# EAGLE design motors (EAGLE 6.4)
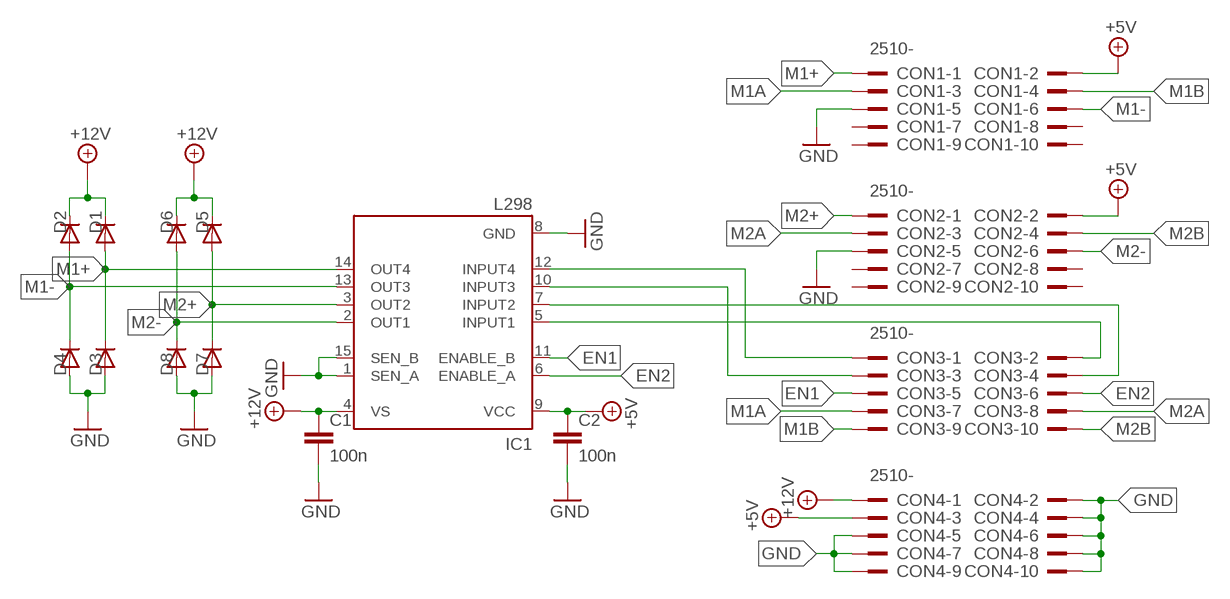
[diagram p0: schematic, sheet 1]

## Parts
C1  100n  C-EU050-025X075  [C050-025X075]
C2  100n  C-EU050-025X075  [C050-025X075]
CON1  2510-  [PAK100/2500-10]
CON2  2510-  [PAK100/2500-10]
CON3  2510-  [PAK100/2500-10]
CON4  2510-  [PAK100/2500-10]
D1  1N4004  [DO41-10]
D2  1N4004  [DO41-10]
D3  1N4004  [DO41-10]
D4  1N4004  [DO41-10]
D5  1N4004  [DO41-10]
D6  1N4004  [DO41-10]
D7  1N4004  [DO41-10]
D8  1N4004  [DO41-10]
IC1  L298  [MULTIWATT-15]

## Nets
+5V: C2.1 CON1.2 CON2.2 CON4.3 IC1.9(VCC)
+12V: C1.1 CON4.1 D1.C D2.C D5.C D6.C IC1.4(VS)
EN1: CON3.5 IC1.11(ENABLE_B)
EN2: CON3.6 IC1.6(ENABLE_A)
GND: C1.2 C2.2 CON1.5 CON2.5 CON4.2 CON4.4 CON4.5 CON4.6 CON4.7 CON4.8 CON4.9 CON4.10 D3.A D4.A D7.A D8.A IC1.1(SEN_A) IC1.8(GND) IC1.15(SEN_B)
M1+: CON1.1 D1.A D3.C IC1.14(OUT4)
M1-: CON1.6 D2.A D4.C IC1.13(OUT3)
M1A: CON1.3 CON3.7
M1B: CON1.4 CON3.9
M2+: CON2.1 D5.A D7.C IC1.3(OUT2)
M2-: CON2.6 D6.A D8.C IC1.2(OUT1)
M2A: CON2.3 CON3.8
M2B: CON2.4 CON3.10
N$1: CON3.3 IC1.10(INPUT3)
N$2: CON3.2 IC1.5(INPUT1)
N$3: CON3.1 IC1.12(INPUT4)
N$11: CON3.4 IC1.7(INPUT2)
Unconnected: CON1.7 CON1.8 CON1.9 CON1.10 CON2.7 CON2.8 CON2.9 CON2.10

## Library data of the parts
C1 C2 = rcl:C-EU: CAPACITOR, European symbol
CON1-CON4 = con-3m:2510-: 3M (TM) Pak 100 4-Wall Header Source: 3M; MF: 3M; MPN: 2510-6002UB; OC_FARNELL: 9838244; OC_NEWARK: 46F4725
D1-D8 = diode:1N4004: DIODE general purpose rectifier, 1 A
IC1 = st-microelectronics:L298: DUAL FULL-BRIDGE DRIVER; MPN: L298N; OC_FARNELL: 1589425; OC_NEWARK: 32M1527

## Board
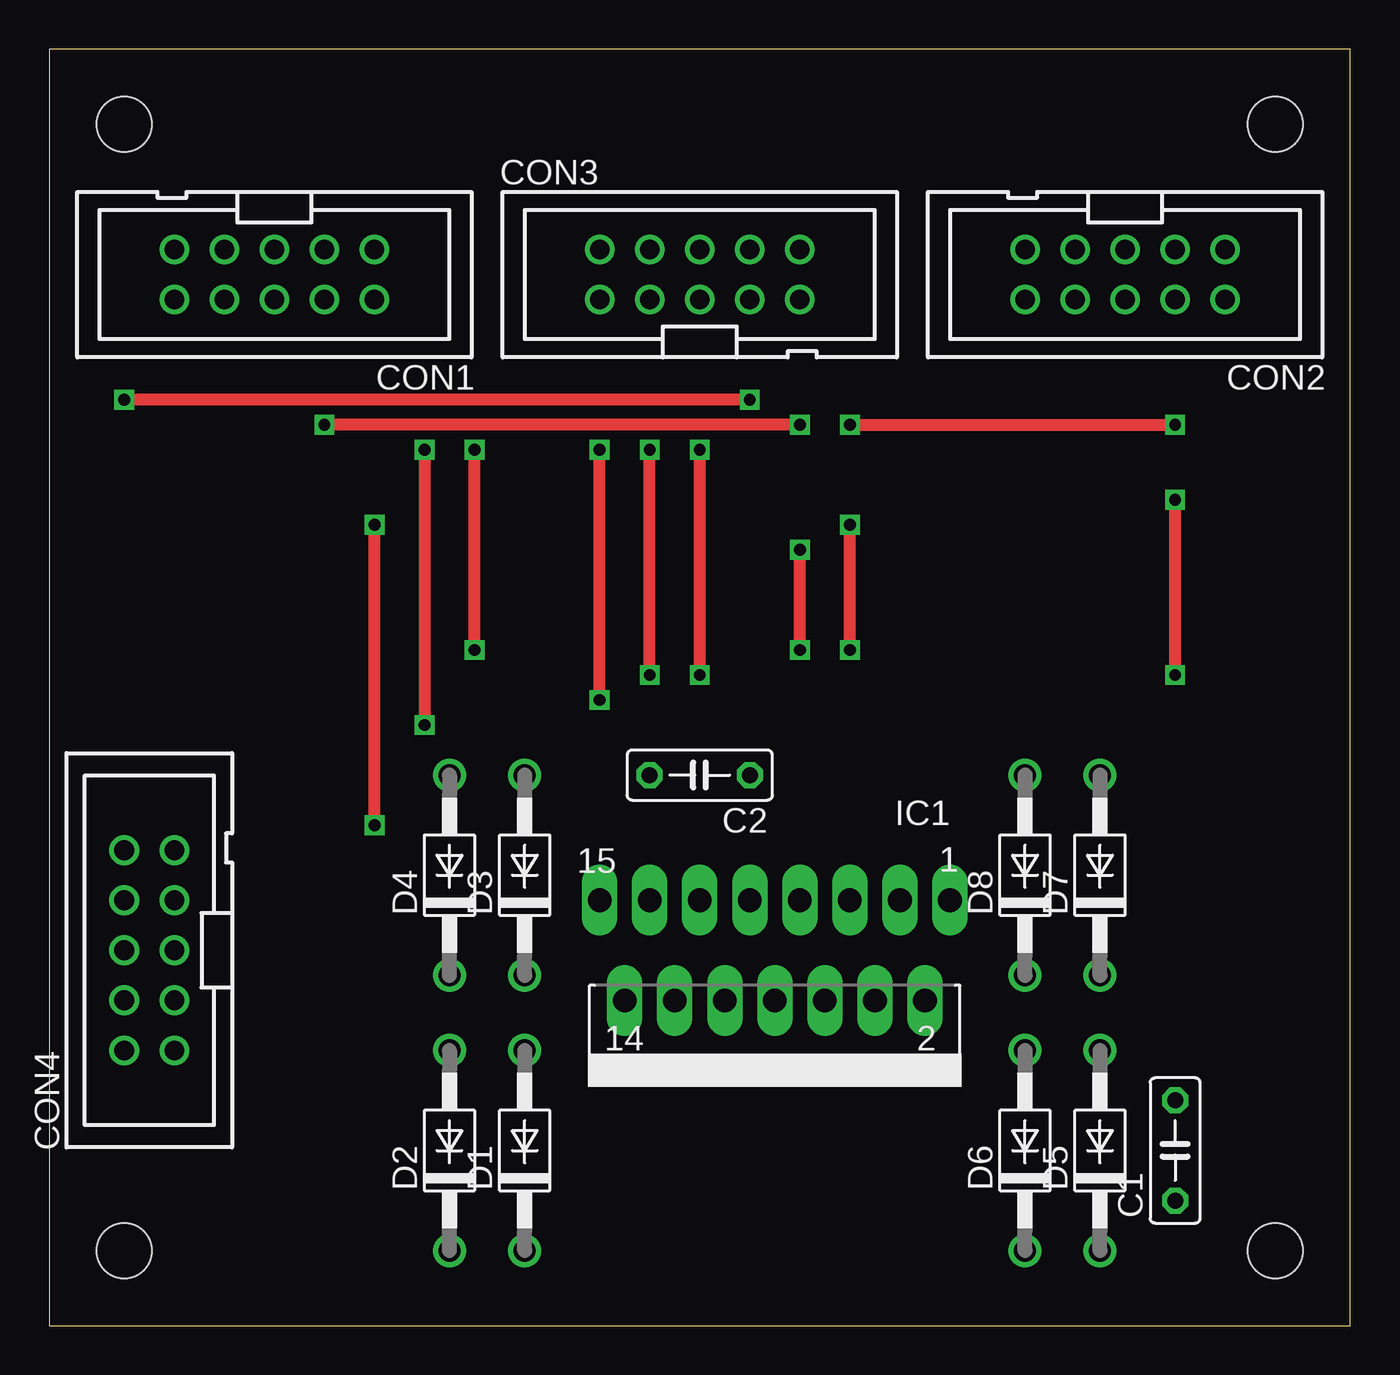
[diagram p1: board, top side]
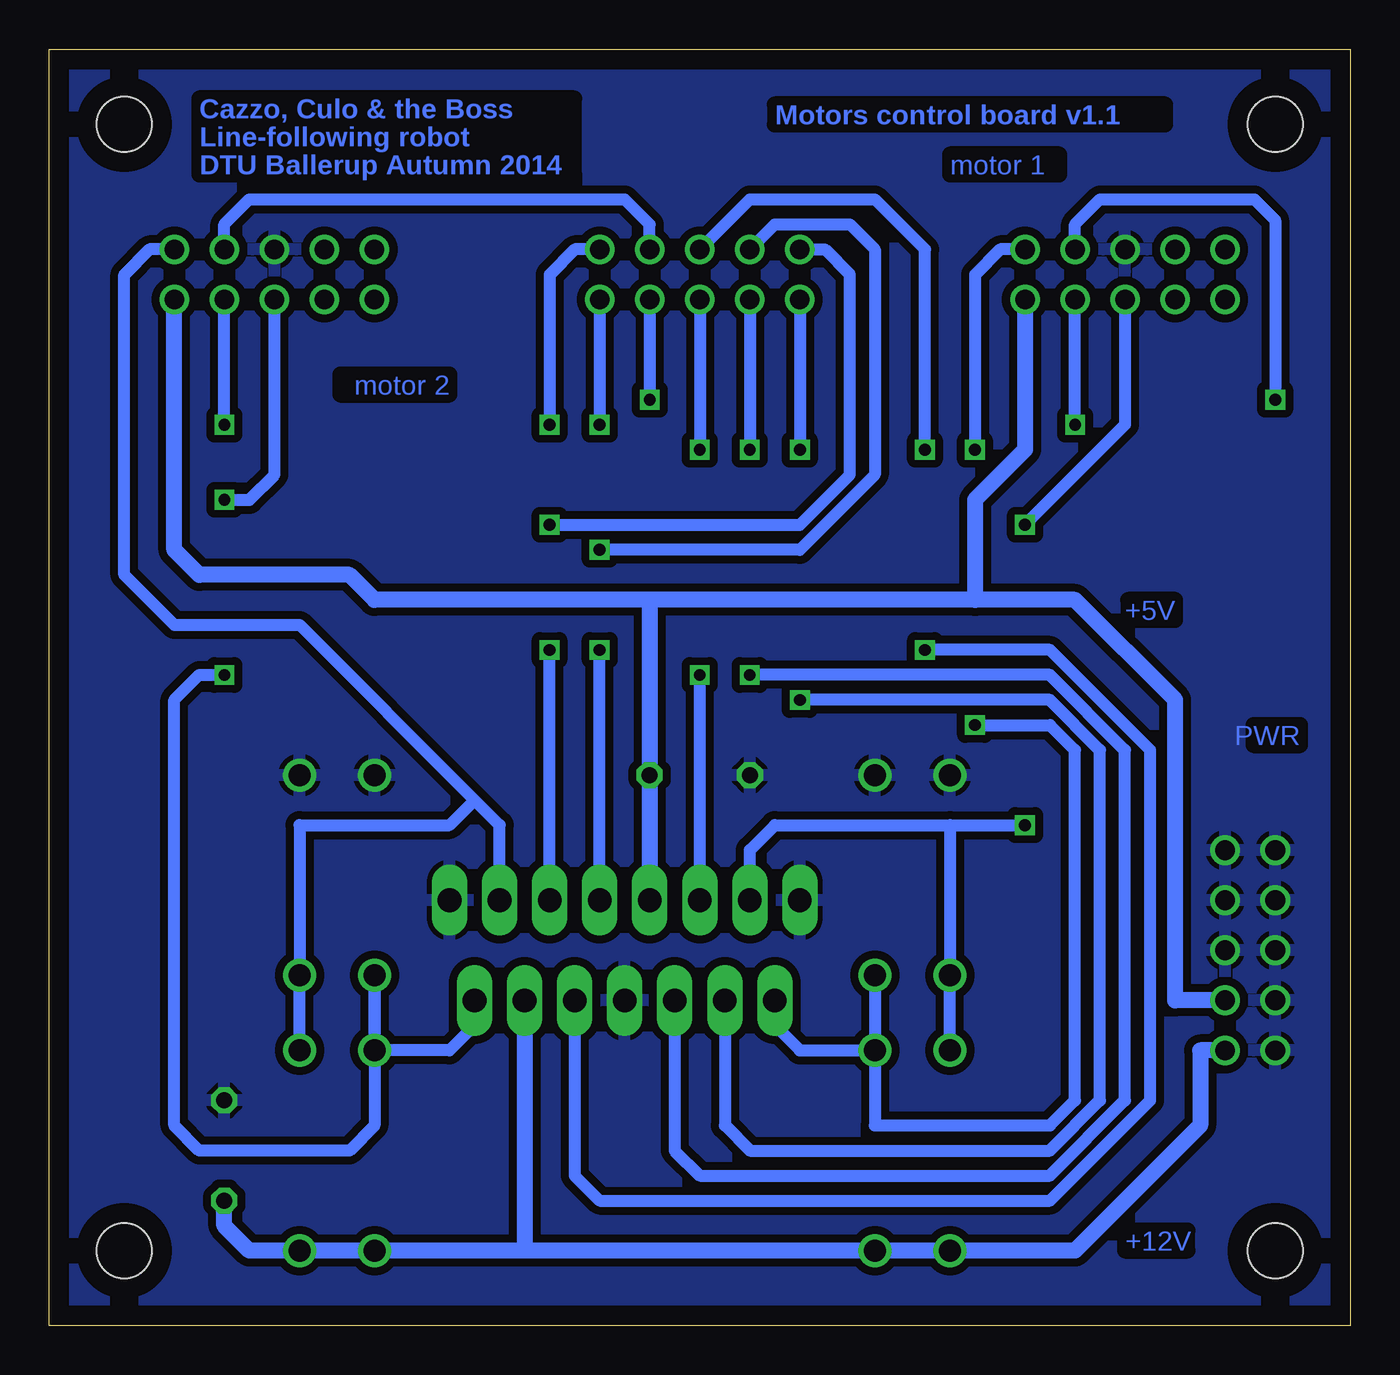
[diagram p2: board, bottom side, seen from below]

Size 66.04 x 64.77 mm. Coordinates in mm from the lower left corner, seen from the top.
Outline: 0,0 66.04,0 66.04,64.77 0,64.77 0,0
Copper layers (1*16): Top 0.035mm / dielectric 1.5mm / Bottom 0.035mm
Design rules "default": minimum track width 10mil, minimum drill 24mil, track to track 8mil, track to pad 8mil, pad to pad 8mil, via to via 8mil, smd to smd 8mil, copper to edge 40mil, drill to drill 8mil, minimum pad ring 10mil, minimum via ring 8mil, stop-mask expansion 4mil, vias tented up to drill 0mil, thermal gap 10mil
Holes 2.8 mm at 3.81,60.96 3.81,3.81 62.23,60.96 62.23,3.81

### Footprints (pad centres in the part's own frame; a part is rotated, then mirrored left to right if it is on the bottom)
C050-025X075 = drill 0.813 octagon: 1 -2.54,0; 2 2.54,0
PAK100/2500-10 = drill 1 pad 1.422: 1 -5.08,-1.27; 2 -5.08,1.27; 3 -2.54,-1.27; 4 -2.54,1.27; 5 0,-1.27; 6 0,1.27; 7 2.54,-1.27; 8 2.54,1.27; 9 5.08,-1.27; 10 5.08,1.27
DO41-10 = drill 1.118: A 5.08,0; C -5.08,0
MULTIWATT-15 = drill 1.2 long: 1 -8.89,-7.62; 2 -7.62,-2.54; 3 -6.35,-7.62; 4 -5.08,-2.54; 5 -3.81,-7.62; 6 -2.54,-2.54; 7 -1.27,-7.62; 8 0,-2.54; 9 1.27,-7.62; 10 2.54,-2.54; 11 3.81,-7.62; 12 5.08,-2.54; 13 6.35,-7.62; 14 7.62,-2.54; 15 8.89,-7.62

### Placement (x,y rotation side)
C1  57.15,8.89 90 top
C2  33.02,27.94 180 top
CON1  11.43,53.34 180 top
CON2  54.61,53.34 180 top
CON3  33.02,53.34 0 top
CON4  5.08,19.05 90 top
D1  24.13,8.89 90 top
D2  20.32,8.89 90 top
D3  24.13,22.86 90 top
D4  20.32,22.86 90 top
D5  53.34,8.89 90 top
D6  49.53,8.89 90 top
D7  53.34,22.86 90 top
D8  49.53,22.86 90 top
IC1  36.83,13.97 180 top

### Tracks (layer width: path | path; a pad name or v marks a point on that pad's centre or on a via)
+5V
  Bottom 0.813: CON4.3 8.89,16.51 8.89,31.75 13.97,36.83 19.05,36.83 | 19.05,36.83 35.56,36.83 | 35.56,36.83 C2.1 IC1.9 | CON1.2 16.51,44.45 19.05,41.91 19.05,36.83 | 35.56,36.83 49.53,36.83 50.8,38.1 58.42,38.1 59.69,39.37 CON2.2
+12V
  Bottom 0.61: D5.C D6.C
  Bottom 0.813: CON4.1 7.62,13.97 7.62,10.16 13.97,3.81 D2.C D1.C 41.91,3.81 | 41.91,3.81 D5.C 55.88,3.81 57.15,5.08 C1.1 | IC1.4 41.91,3.81
EN1  (via drill 0.6)
  Top 0.61: v33.02,33.02 v33.02,44.45
  Bottom 0.61: CON3.5 v33.02,44.45 | IC1.11 v33.02,33.02
EN2  (via drill 0.6)
  Top 0.61: v21.59,34.29 v21.59,44.45
  Bottom 0.61: CON3.6 30.48,57.15 24.13,57.15 21.59,54.61 v21.59,44.45 | 39.37,12.7 IC1.6 39.37,7.62 38.1,6.35 15.24,6.35 10.16,11.43 10.16,29.21 15.24,34.29 v21.59,34.29
GND
  pour Bottom (isolate 0.406): 0,64.77 66.04,64.77 66.04,0 0,0
M1+  (via drill 0.6)
  Top 0.61: v19.05,44.45 v19.05,30.48
  Bottom 0.61: IC1.14 29.21,15.24 27.94,13.97 D1.A D3.C 24.13,10.16 15.24,10.16 13.97,11.43 13.97,29.21 15.24,30.48 v19.05,30.48 | CON1.1 17.78,54.61 19.05,53.34 v19.05,44.45
M1-  (via drill 0.6)
  Top 0.61: v16.51,25.4 v16.51,40.64
  Bottom 0.61: D2.A D4.C 20.32,25.4 | IC1.13 30.48,24.13 29.21,25.4 20.32,25.4 | CON1.6 11.43,45.72 v16.51,40.64 | 20.32,25.4 v16.51,25.4
M1A  (via drill 0.6)
  Top 0.61: v35.56,46.99 v3.81,46.99
  Bottom 0.61: CON1.3 13.97,55.88 12.7,57.15 4.86,57.15 3.81,56.1 v3.81,46.99 | CON3.7 v35.56,46.99
M1B  (via drill 0.6)
  Top 0.61: v38.1,45.72 v13.97,45.72
  Bottom 0.61: CON3.9 v38.1,45.72 | v13.97,45.72 CON1.4
M2+
  Bottom 0.61: D5.A D7.C 53.34,25.4 45.72,25.4 44.45,26.67 | CON2.1 60.96,54.61 62.23,53.34 62.23,38.1 59.69,35.56 53.34,35.56 44.45,26.67 | IC1.3 43.18,25.4 44.45,26.67
M2-  (via drill 0.6)
  Top 0.61: v57.15,33.02 v57.15,41.91
  Bottom 0.61: IC1.2 44.45,15.24 45.72,13.97 D6.A D8.C 49.53,10.16 50.8,8.89 58.42,8.89 59.69,10.16 59.69,31.75 58.42,33.02 v57.15,33.02 | v57.15,41.91 55.88,41.91 54.61,43.18 CON2.6
M2A
  Bottom 0.61: CON3.8 35.56,55.88 36.83,57.15 55.88,57.15 57.15,55.88 CON2.3
M2B  (via drill 0.6)
  Top 0.61: v40.64,45.72 v57.15,45.72
  Bottom 0.61: CON3.10 39.37,54.61 40.64,53.34 v40.64,45.72 | v57.15,45.72 CON2.4
N$1  (via drill 0.6)
  Top 0.61: v30.48,33.02 v30.48,44.45
  Bottom 0.61: CON3.3 v30.48,44.45 | 34.29,12.7 IC1.10 34.29,8.89 33.02,7.62 15.24,7.62 11.43,11.43 11.43,29.21 15.24,33.02 v30.48,33.02
N$2  (via drill 0.6)
  Top 0.61: v40.64,34.29 v40.64,40.64
  Bottom 0.61: IC1.5 v40.64,34.29 | CON3.2 26.67,54.61 25.4,53.34 25.4,43.18 27.94,40.64 v40.64,40.64
N$3  (via drill 0.6)
  Top 0.61: v27.94,31.75 v27.94,44.45
  Bottom 0.61: CON3.1 v27.94,44.45 | IC1.12 31.75,10.16 30.48,8.89 15.24,8.89 12.7,11.43 12.7,29.21 15.24,31.75 v27.94,31.75
N$11  (via drill 0.6)
  Top 0.61: v38.1,34.29 v38.1,39.37
  Bottom 0.61: CON3.4 29.21,55.88 25.4,55.88 24.13,54.61 24.13,43.18 27.94,39.37 v38.1,39.37 | IC1.7 v38.1,34.29

### Text on the board
Bottom: Motors control board v1.1 | motor 1 | Cazzo, Culo & the Boss / Line-following robot / DTU Ballerup Autumn 2014 | motor 2 | +5V | PWR | +12V